# EAGLE design HPI_dice (EAGLE 6.6.0)
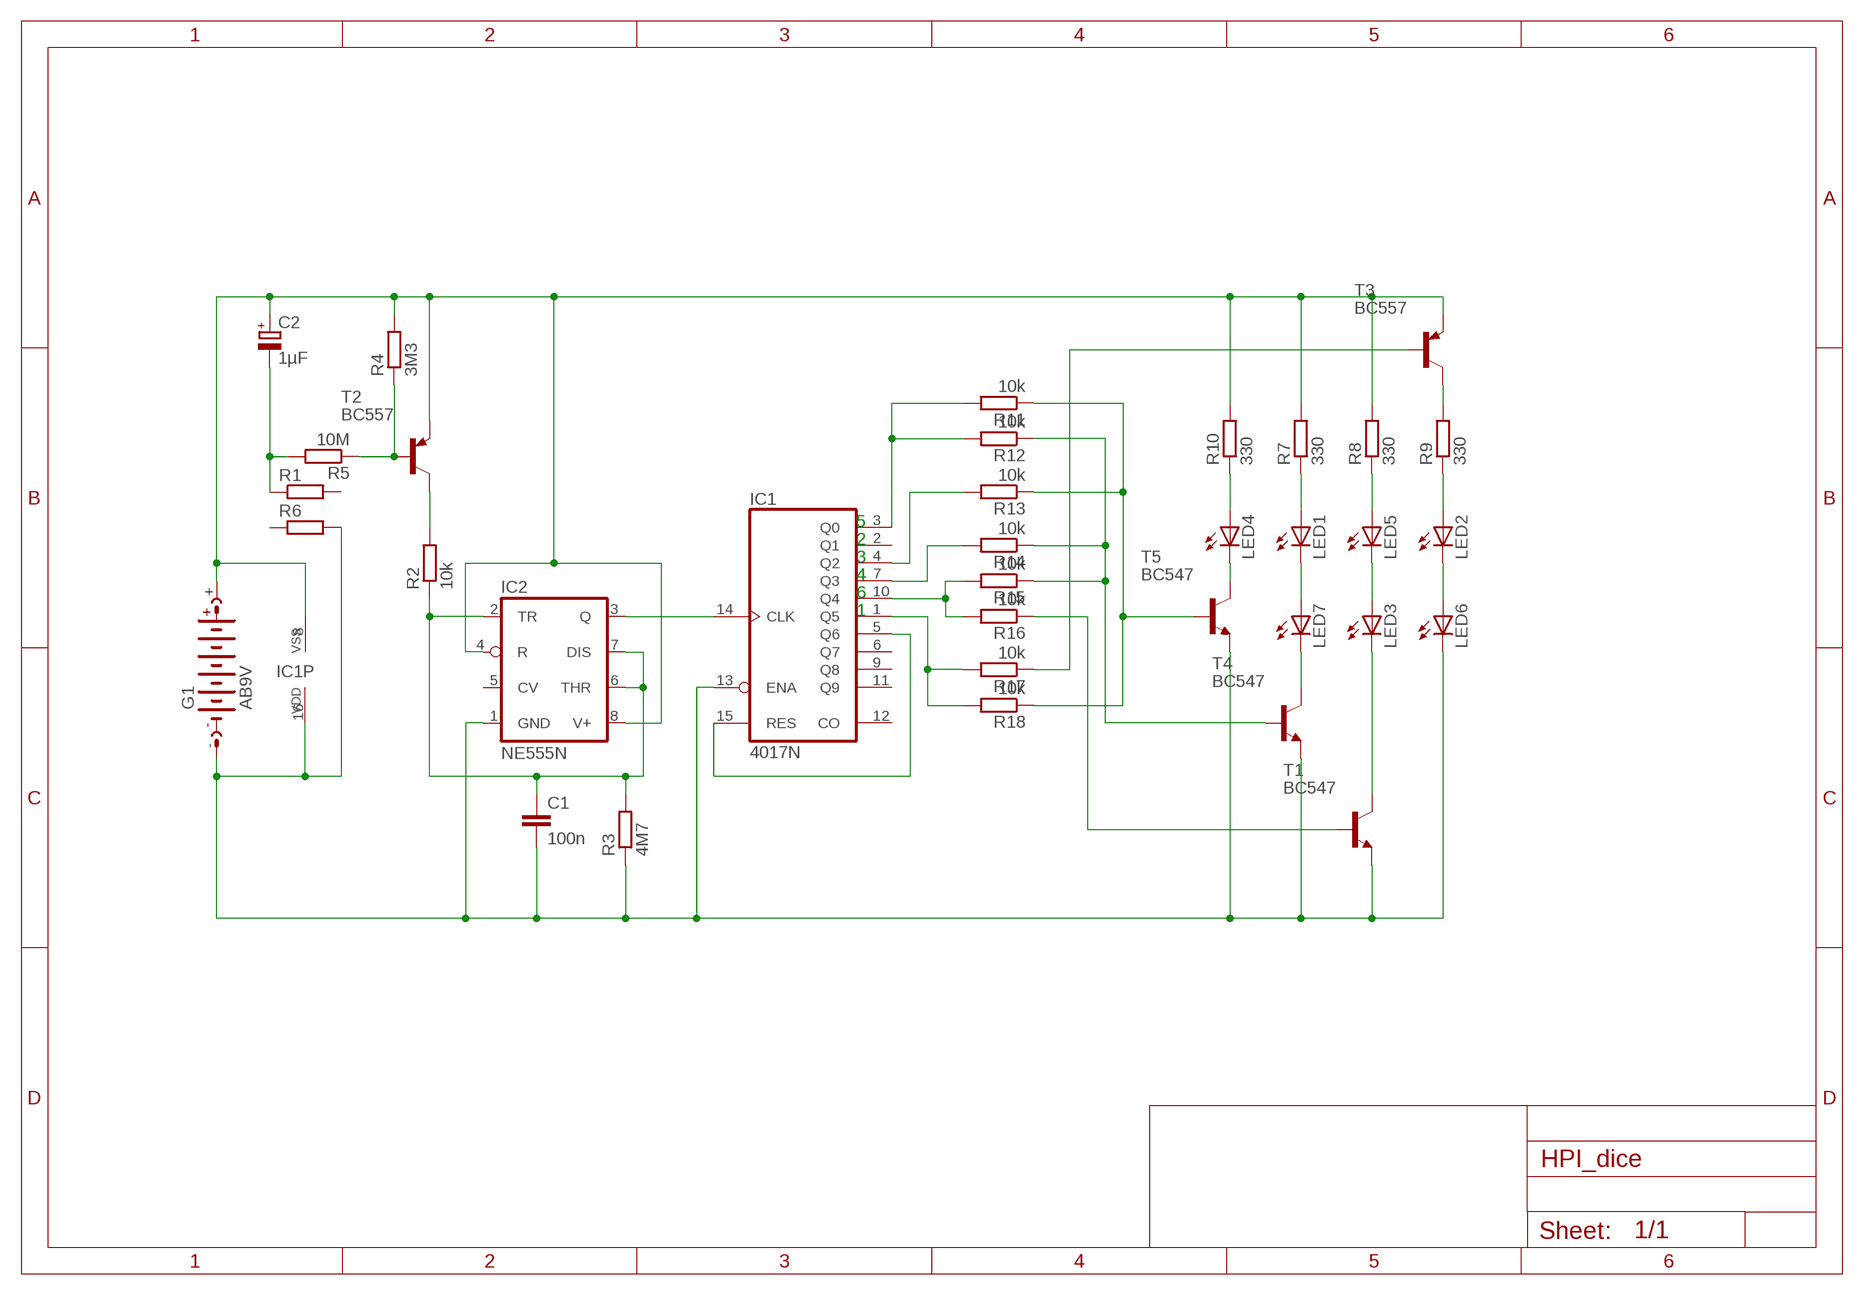
[diagram p0: schematic, sheet 1]

## Parts
C1  100n  C-EU050-025X075  [C050-025X075]
C2  1µF  CPOL-EUE2.5-6  [E2,5-6]
G1  AB9V  [AB9V]
IC1  4017N  [DIL16]
IC2  NE555N  [DIL08]
LED1  LED3MM  [LED3MM]
LED2  LED3MM  [LED3MM]
LED3  LED3MM  [LED3MM]
LED4  LED3MM  [LED3MM]
LED5  LED3MM  [LED3MM]
LED6  LED3MM  [LED3MM]
LED7  LED3MM  [LED3MM]
R1  R-EU_0207/10  [0207/10]
R2  10k  R-EU_0207/10  [0207/10]
R3  4M7  R-EU_0207/10  [0207/10]
R4  3M3  R-EU_0207/10  [0207/10]
R5  10M  R-EU_0207/10  [0207/10]
R6  R-EU_0207/10  [0207/10]
R7  330  R-EU_0207/10  [0207/10]
R8  330  R-EU_0207/10  [0207/10]
R9  330  R-EU_0207/10  [0207/10]
R10  330  R-EU_0207/10  [0207/10]
R11  10k  R-EU_0207/10  [0207/10]
R12  10k  R-EU_0207/10  [0207/10]
R13  10k  R-EU_0207/10  [0207/10]
R14  10k  R-EU_0207/10  [0207/10]
R15  10k  R-EU_0207/10  [0207/10]
R16  10k  R-EU_0207/10  [0207/10]
R17  10k  R-EU_0207/10  [0207/10]
R18  10k  R-EU_0207/10  [0207/10]
T1  BC547  [TO92]
T2  BC557  [TO92]
T3  BC557  [TO92]
T4  BC547  [TO92]
T5  BC547  [TO92]

## Nets
+9V: C2.+ G1.+ IC1.8(VSS) IC2.4(R) IC2.8(V+) R4.2 R7.2 R8.2 R10.2 T2.1(E) T3.1(E)
GND: C1.2 G1.- IC1.13(ENA) IC1.16(VDD) IC2.1(GND) LED6.K(C) R3.1 R6.2 T1.1(E) T4.1(E) T5.1(E)
N$1: IC1.5(Q6) IC1.15(RES)
N$2: R2.2 T2.3(C)
N$3: IC1.14(CLK) IC2.3(Q)
N$4: C1.1 IC2.2(TR) IC2.6(THR) IC2.7(DIS) R2.1 R3.2
N$5: R4.1 R5.1 T2.2(B)
N$6: C2.- R1.1 R5.2
N$7: LED1.K(C) LED7.A
N$8: LED3.A LED5.K(C)
N$9: LED2.K(C) LED6.A
N$10: R9.2 T3.3(C)
N$11: LED2.A R9.1
N$12: LED5.A R8.1
N$13: LED1.A R7.1
N$14: LED3.K(C) T1.3(C)
N$15: LED7.K(C) T4.3(C)
N$16: LED4.A R10.1
N$17: LED4.K(C) T5.3(C)
N$18: IC1.3(Q0) R11.2 R12.2
N$19: R11.1 R13.1 R18.1 T5.2(B)
N$20: R12.1 R14.1 R15.1 T4.2(B)
N$21: IC1.4(Q2) R13.2
N$22: IC1.7(Q3) R14.2
N$23: IC1.10(Q4) R15.2 R16.2
N$24: R16.1 T1.2(B)
N$25: IC1.1(Q5) R17.2 R18.2
N$26: R17.1 T3.2(B)
Unconnected: IC1.2(Q1) IC1.6(Q7) IC1.9(Q8) IC1.11(Q9) IC1.12(CO) IC2.5(CV) R1.2 R6.1

## Notes on the sheet
- 5
- 2
- 3
- 4
- 6
- 1

## Library data of the parts
C1 = resistor:C-EU: CAPACITOR, European symbol
C2 = resistor:CPOL-EU: POLARIZED CAPACITOR, European symbol
G1 = battery:AB9V: 9-V BATTERY CLIP
IC1 = 40xx:4017: COUNTER/DIVIDER
IC2 = linear:*555: TIMER
LED1-LED7 = led:LED: LED OSRAM: - CHIPLED LG R971, LG N971, LY N971, LG Q971, LY Q971, LO R971, LY R971 LH N974, LH R974 LS Q976, LO Q976, LY Q976 LO Q996 - Hyper CHIPLED LW Q18S LB Q993, LB Q99A, LB R99A - SideLED LS A670, LO A670, LY A670, LG A670, LP A670 LB A673, LV A673, LT A673, LW A673 LH A674 LY A675 LS A676, LA A676, LO A676, LY A676, LW A676 LS A679, LY A679, LG A679 - Hyper Micro SIDELED® LS Y876, LA Y876, LO Y876, LY Y876 LT Y87S - SmartLED LW L88C, LW L88S LB L89C, LB L89S, LG L890 LS L89K, LO L89K, LY L89K LS L896, LA L896, LO L896, LY L896 - TOPLED LS T670, LO T670, LY T670, LG T670, LP T670 LSG T670, LSP T670, LSY T670, LOP T670, LYG T670 LG T671, LOG T671, LSG T671 LB T673, LV T673, LT T673, LW T673 LH T674 LS T676, LA T676, LO T676, LY T676, LB T676, LH T676, LSB T676, LW T676 LB T67C, LV T67C, LT T67C, LS T67K, LO T67K, LY T67K, LW E67C LS E67B, LA E67B, LO E67B, LY E67B, LB E67C, LV E67C, LT E67C LW T67C LS T679, LY T679, LG T679 LS T770, LO T770, LY T770, LG T770, LP T770 LB T773, LV T773, LT T773, LW T773 LH T774 LS E675, LA E675, LY E675, LS T675 LS T776, LA T776, LO T776, LY T776, LB T776 LHGB T686 LT T68C, LB T68C - Hyper Mini TOPLED® LB M676 - Mini TOPLED Santana® LG M470 LS M47K, LO M47K, LY M47K Source: http://www.osram.convergy.de LUXEON: - LUMILED® LXK2-PW12-R00, LXK2-PW12-S00, LXK2-PW14-U00, LXK2-PW14-V00 LXK2-PM12-R00, LXK2-PM12-S00, LXK2-PM14-U00 LXK2-PE12-Q00, LXK2-PE12-R00, LXK2-PE12-S00, LXK2-PE14-T00, LXK2-PE14-U00 LXK2-PB12-K00, LXK2-PB12-L00, LXK2-PB12-M00, LXK2-PB14-N00, LXK2-PB14-P00, LXK2-PB14-Q00 LXK2-PR12-L00, LXK2-PR12-M00, LXK2-PR14-Q00, LXK2-PR14-R00 LXK2-PD12-Q00, LXK2-PD12-R00, LXK2-PD12-S00 LXK2-PH12-R00, LXK2-PH12-S00 LXK2-PL12-P00, LXK2-PL12-Q00, LXK2-PL12-R00 Source: www.luxeon.com KINGBRIGHT: KA-3528ASYC Source: www.kingbright.com
R1-R18 = resistor:R-EU_: RESISTOR, European symbol
T1 T4 T5 = transistor:BC547: NPN TRANSISTOR
T2 T3 = transistor-pnp:BC557: PNP Transistor

## Net classes
0 default: width 0.61 mm

## Board
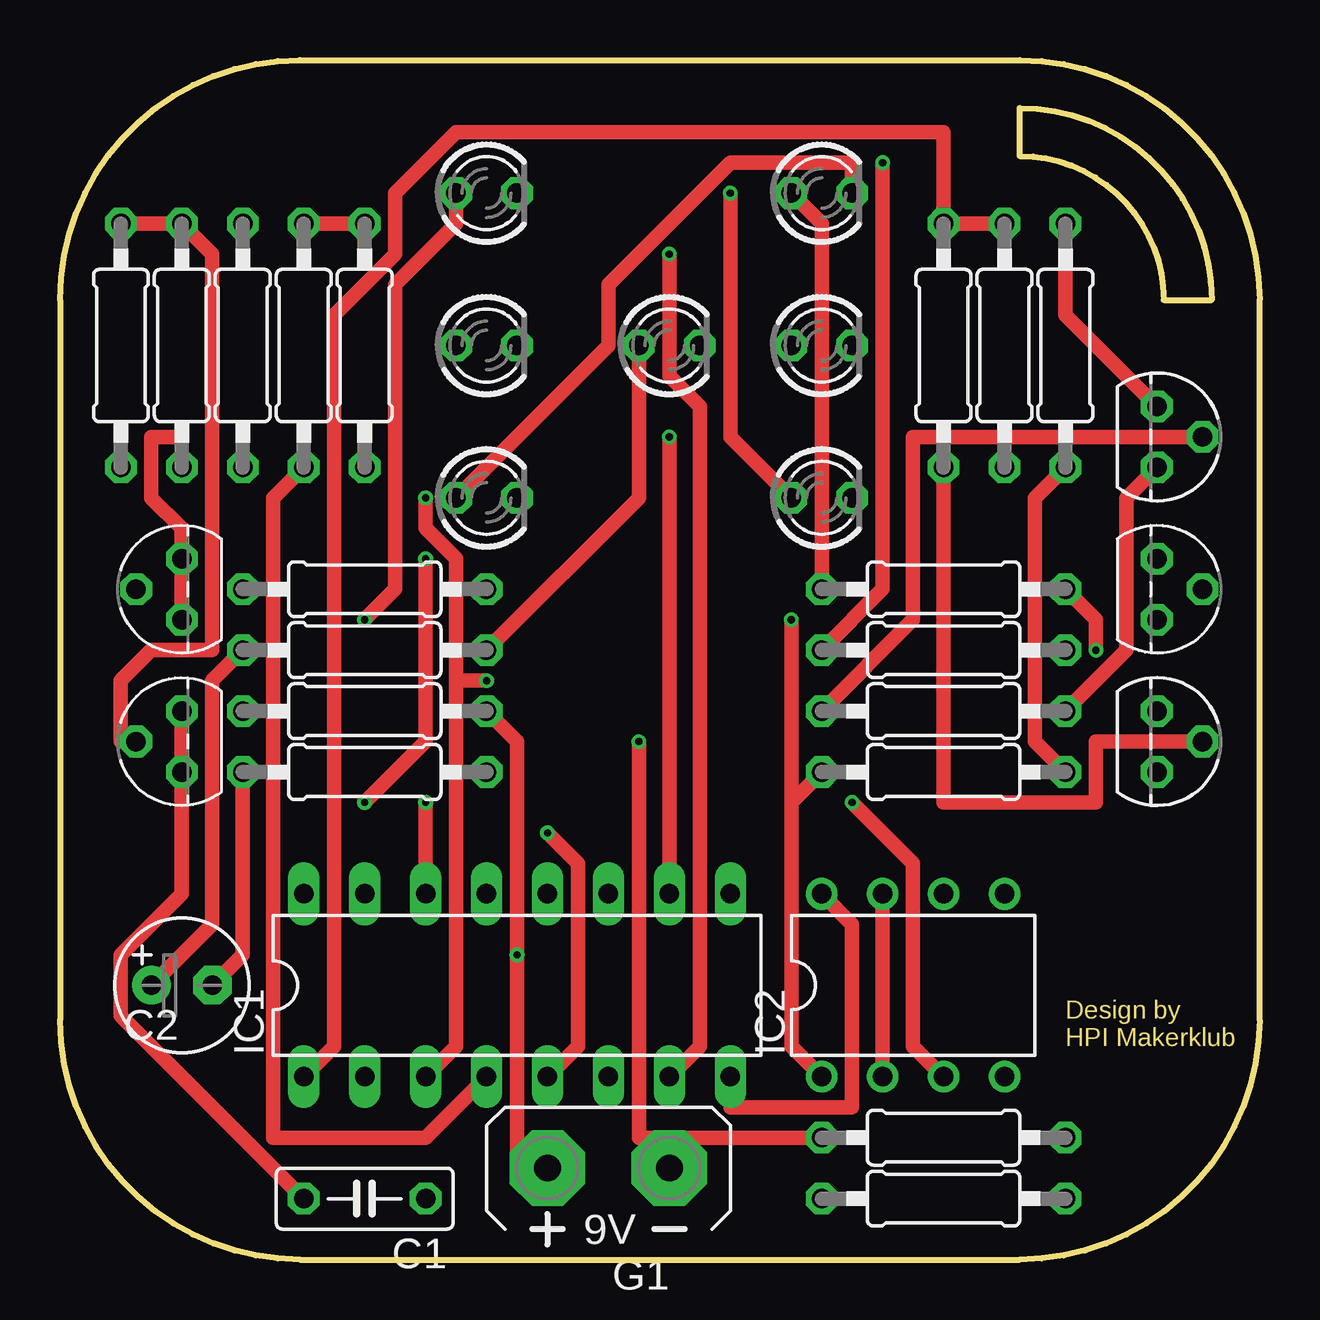
[diagram p1: board, top side]
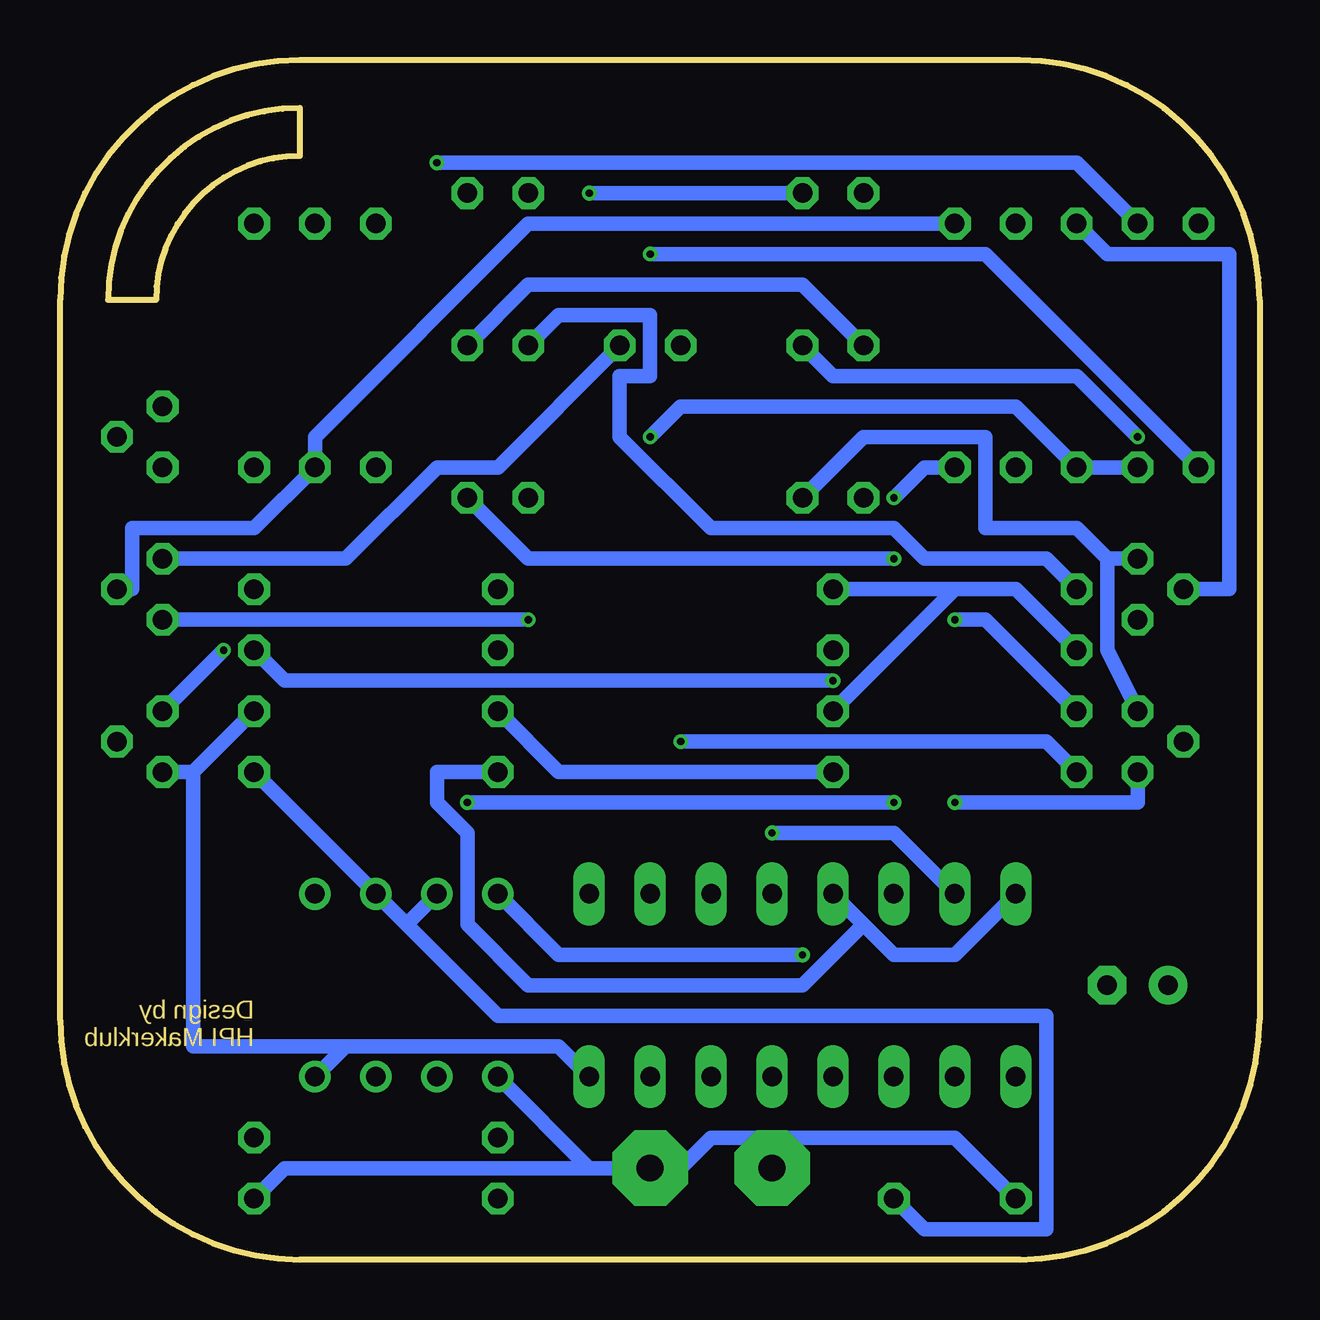
[diagram p2: board, bottom side, seen from below]

Size 50 x 50 mm. Coordinates in mm from the lower left corner, seen from the top.
Outline: 50,10 50,40 arc90 40,50 10,50 arc90 0,40 0,10 arc90 10,0 40,0 arc90 50,10
Outline: 40,48 arc-90 48,40 46,40 arc90 40,46 40,48
Copper layers (1*16): Top 0.035mm / dielectric 1.5mm / Bottom 0.035mm
Design rules "dirt_cheap_dirty_boards.v1": minimum track width 5mil, minimum drill 12mil, track to track 5mil, track to pad 5mil, pad to pad 5mil, via to via 5mil, smd to smd 0mil, copper to edge 10mil, drill to drill 10mil, minimum pad ring 10mil, minimum via ring 6mil, stop-mask expansion 2mil, vias tented up to drill 25mil, thermal gap 10mil

### Footprints (pad centres in the part's own frame; a part is rotated, then mirrored left to right if it is on the bottom)
C050-025X075 = drill 0.813 octagon: 1 -2.54,0; 2 2.54,0
E2,5-6 = drill 0.813 pad 1.6: + -1.27,0 | drill 0.813 pad 1.6 octagon: - 1.27,0
AB9V = drill 1.118 pad 3.15 octagon: + 0,2.54; - 0,-2.54
DIL16 = drill 0.813 long: 1 -8.89,-3.81; 2 -6.35,-3.81; 3 -3.81,-3.81; 4 -1.27,-3.81; 5 1.27,-3.81; 6 3.81,-3.81; 7 6.35,-3.81; 8 8.89,-3.81; 9 8.89,3.81; 10 6.35,3.81; 11 3.81,3.81; 12 1.27,3.81; 13 -1.27,3.81; 14 -3.81,3.81; 15 -6.35,3.81; 16 -8.89,3.81
DIL08 = drill 0.813 pad 1.27: 1 -3.81,-3.81; 2 -1.27,-3.81; 3 1.27,-3.81; 4 3.81,-3.81; 5 3.81,3.81; 6 1.27,3.81; 7 -1.27,3.81; 8 -3.81,3.81
LED3MM = drill 0.813 octagon: A -1.27,0; K 1.27,0
0207/10 = drill 0.813 octagon: 1 -5.08,0; 2 5.08,0
TO92 = drill 0.813 octagon: 1 1.27,0; 2 0,1.905; 3 -1.27,0

### Placement (x,y rotation side)
C1  12.7,2.54 180 top
C2  5.08,11.43 0 top
G1  22.86,3.81 90 top
IC1  19.05,11.43 0 top
IC2  35.56,11.43 0 top
LED1  17.78,44.45 0 top
LED2  31.75,44.45 0 top
LED3  17.78,38.1 0 top
LED4  25.4,38.1 0 top
LED5  31.75,38.1 0 top
LED6  17.78,31.75 0 top
LED7  31.75,31.75 0 top
R1  36.83,5.08 0 top
R2  41.91,38.1 90 top
R3  36.83,20.32 0 top
R4  36.83,22.86 0 top
R5  12.7,20.32 180 top
R6  36.83,2.54 0 top
R7  12.7,22.86 0 top
R8  12.7,27.94 0 top
R9  36.83,27.94 0 top
R10  12.7,25.4 180 top
R11  12.7,38.1 270 top
R12  36.83,25.4 0 top
R13  10.16,38.1 270 top
R14  2.54,38.1 270 top
R15  5.08,38.1 270 top
R16  7.62,38.1 270 top
R17  36.83,38.1 90 top
R18  39.37,38.1 90 top
T1  5.08,27.94 90 top
T2  45.72,34.29 270 top
T3  45.72,21.59 270 top
T4  5.08,21.59 90 top
T5  45.72,27.94 270 top

### Tracks (layer width: path | path; a pad name or v marks a point on that pad's centre or on a via)
+9V  (via drill 0.3)
  Top 0.61: T2.1 44.45,31.75 44.45,25.4 R4.2 | IC2.8 33.02,13.97 33.02,6.35 27.94,6.35 IC1.8 | C2.+ 6.35,13.97 6.35,24.13 R10.2 | G1.+ 19.05,3.81 v19.05,12.7 19.05,21.59 R7.2
  Bottom 0.61: 44.45,20.32 R4.2 | T3.1 44.45,20.32 | IC1.8 29.21,8.89 38.1,8.89 | IC2.4 38.1,8.89 | 44.45,20.32 44.45,8.89 38.1,8.89 | R10.2 10.16,27.94 12.7,27.94 | R8.2 12.7,27.94 | 12.7,27.94 R7.2 | IC2.8 29.21,12.7 v19.05,12.7
GND  (via drill 0.3)
  Top 0.61: 30.48,19.05 R3.1 | 30.48,19.05 30.48,8.89 IC2.1 | 30.48,19.05 v30.48,26.67 | T4.1 5.08,15.24 2.54,12.7 2.54,10.16 C1.2
  Bottom 0.61: T4.1 6.35,25.4 6.35,29.21 | T1.1 6.35,29.21 | LED6.K 16.51,34.29 11.43,34.29 11.43,30.48 7.62,30.48 6.35,29.21 | IC1.16 12.7,12.7 15.24,12.7 16.51,13.97 | IC1.13 16.51,13.97 | C1.2 12.7,5.08 22.86,5.08 24.13,3.81 G1.- 27.94,3.81 | R6.2 40.64,3.81 27.94,3.81 | 27.94,3.81 IC2.1 | v30.48,26.67 T5.1 | 16.51,13.97 19.05,11.43 30.48,11.43 33.02,13.97 33.02,17.78 34.29,19.05 34.29,20.32 R3.1
N$1  (via drill 0.3)
  Top 0.61: v20.32,17.78 21.59,16.51 21.59,8.89 IC1.5
  Bottom 0.61: IC1.15 15.24,17.78 v20.32,17.78
N$2
  Top 0.61: T2.3 41.91,39.37 R2.2
N$3  (via drill 0.3)
  Top 0.61: v15.24,19.05 IC1.14 | v33.02,19.05 35.56,16.51 35.56,8.89 IC2.3
  Bottom 0.61: v33.02,19.05 v15.24,19.05
N$4
  Top 0.61: IC2.7 IC2.2 | R2.1 40.64,31.75 40.64,21.59 R3.2
  Bottom 0.61: C1.1 13.97,1.27 8.89,1.27 8.89,10.16 31.75,10.16 35.56,13.97 | 35.56,13.97 IC2.6 R3.2 | 35.56,13.97 IC2.7
N$5
  Top 0.61: T2.2 35.56,34.29 35.56,26.67 R4.1
  Bottom 0.61: R5.1 29.21,20.32 R4.1
N$6  (via drill 0.3)
  Top 0.61: R5.2 7.62,12.7 C2.- | R1.1 24.13,5.08 v24.13,21.59
  Bottom 0.61: v24.13,21.59 8.89,21.59 R5.2
N$7  (via drill 0.3)
  Top 0.61: LED7.A 27.94,34.29 v27.94,44.45
  Bottom 0.61: LED1.K v27.94,44.45
N$8
  Bottom 0.61: LED3.A 19.05,40.64 30.48,40.64 LED5.K
N$9
  Top 0.61: LED6.A 22.86,38.1 22.86,40.64 27.94,45.72 33.02,45.72 LED2.K
N$10  (via drill 0.3)
  Top 0.61: v43.18,25.4 43.18,26.67 R9.2
  Bottom 0.61: v43.18,25.4 T3.3
N$11
  Top 0.61: R9.1 31.75,43.18 LED2.A
N$12
  Bottom 0.61: R8.1 8.89,29.21 13.97,29.21 15.24,30.48 22.86,30.48 26.67,34.29 26.67,36.83 25.4,36.83 25.4,39.37 29.21,39.37 LED5.A
N$13  (via drill 0.3)
  Top 0.61: v12.7,26.67 13.97,27.94 13.97,40.64 16.51,43.18 LED1.A
  Bottom 0.61: R7.1 11.43,26.67 v12.7,26.67
N$14  (via drill 0.3)
  Top 0.61: T1.3 5.08,30.48 3.81,31.75 3.81,34.29 v5.08,34.29
  Bottom 0.61: v5.08,34.29 7.62,36.83 17.78,36.83 LED3.K
N$15  (via drill 0.3)
  Top 0.61: v12.7,19.05 15.24,21.59 v15.24,29.21
  Bottom 0.61: T4.3 5.08,19.05 v12.7,19.05 | v15.24,29.21 30.48,29.21 LED7.K
N$16
  Top 0.61: R10.1 24.13,31.75 LED4.A
N$17
  Bottom 0.61: LED4.K 31.75,33.02 34.29,33.02 38.1,29.21 T5.3
N$18  (via drill 0.3)
  Top 0.61: IC1.3 16.51,8.89 16.51,24.13 | 16.51,24.13 16.51,29.21 15.24,30.48 v15.24,31.75 | 16.51,24.13 v17.78,24.13
  Bottom 0.61: v15.24,31.75 13.97,33.02 R11.2 | R12.2 40.64,24.13 v17.78,24.13
N$19
  Top 0.61: R11.1 R13.1
  Bottom 0.61: T5.2 46.99,27.94 46.99,30.48 41.91,30.48 R18.1 39.37,34.29 30.48,43.18 R11.1
N$20  (via drill 0.3)
  Top 0.61: T4.2 2.54,21.59 2.54,24.13 3.81,25.4 6.35,25.4 6.35,41.91 R15.1 R14.1 | R12.1 34.29,27.94 v34.29,45.72
  Bottom 0.61: v34.29,45.72 7.62,45.72 R15.1
N$21
  Top 0.61: IC1.4 15.24,5.08 8.89,5.08 8.89,31.75 R13.2
N$22  (via drill 0.3)
  Top 0.61: IC1.7 26.67,8.89 26.67,35.56 25.4,36.83 v25.4,41.91
  Bottom 0.61: v25.4,41.91 11.43,41.91 R14.2
N$23  (via drill 0.3)
  Top 0.61: v25.4,34.29 IC1.10
  Bottom 0.61: R15.2 R16.2 10.16,35.56 24.13,35.56 v25.4,34.29
N$24
  Bottom 0.61: R16.1 6.35,41.91 1.27,41.91 1.27,27.94 T1.2
N$25
  Top 0.61: IC1.1 11.43,8.89 11.43,39.37 13.97,41.91 13.97,44.45 16.51,46.99 36.83,46.99 R17.2 R18.2
N$26
  Top 0.61: T3.2 43.18,21.59 43.18,19.05 36.83,19.05 R17.1

### Text on the board
Dimension: Design by / HPI Makerklub
tValues: Hasso Plattner Institut